# Altium project ODrive_Foc.PrjPcb
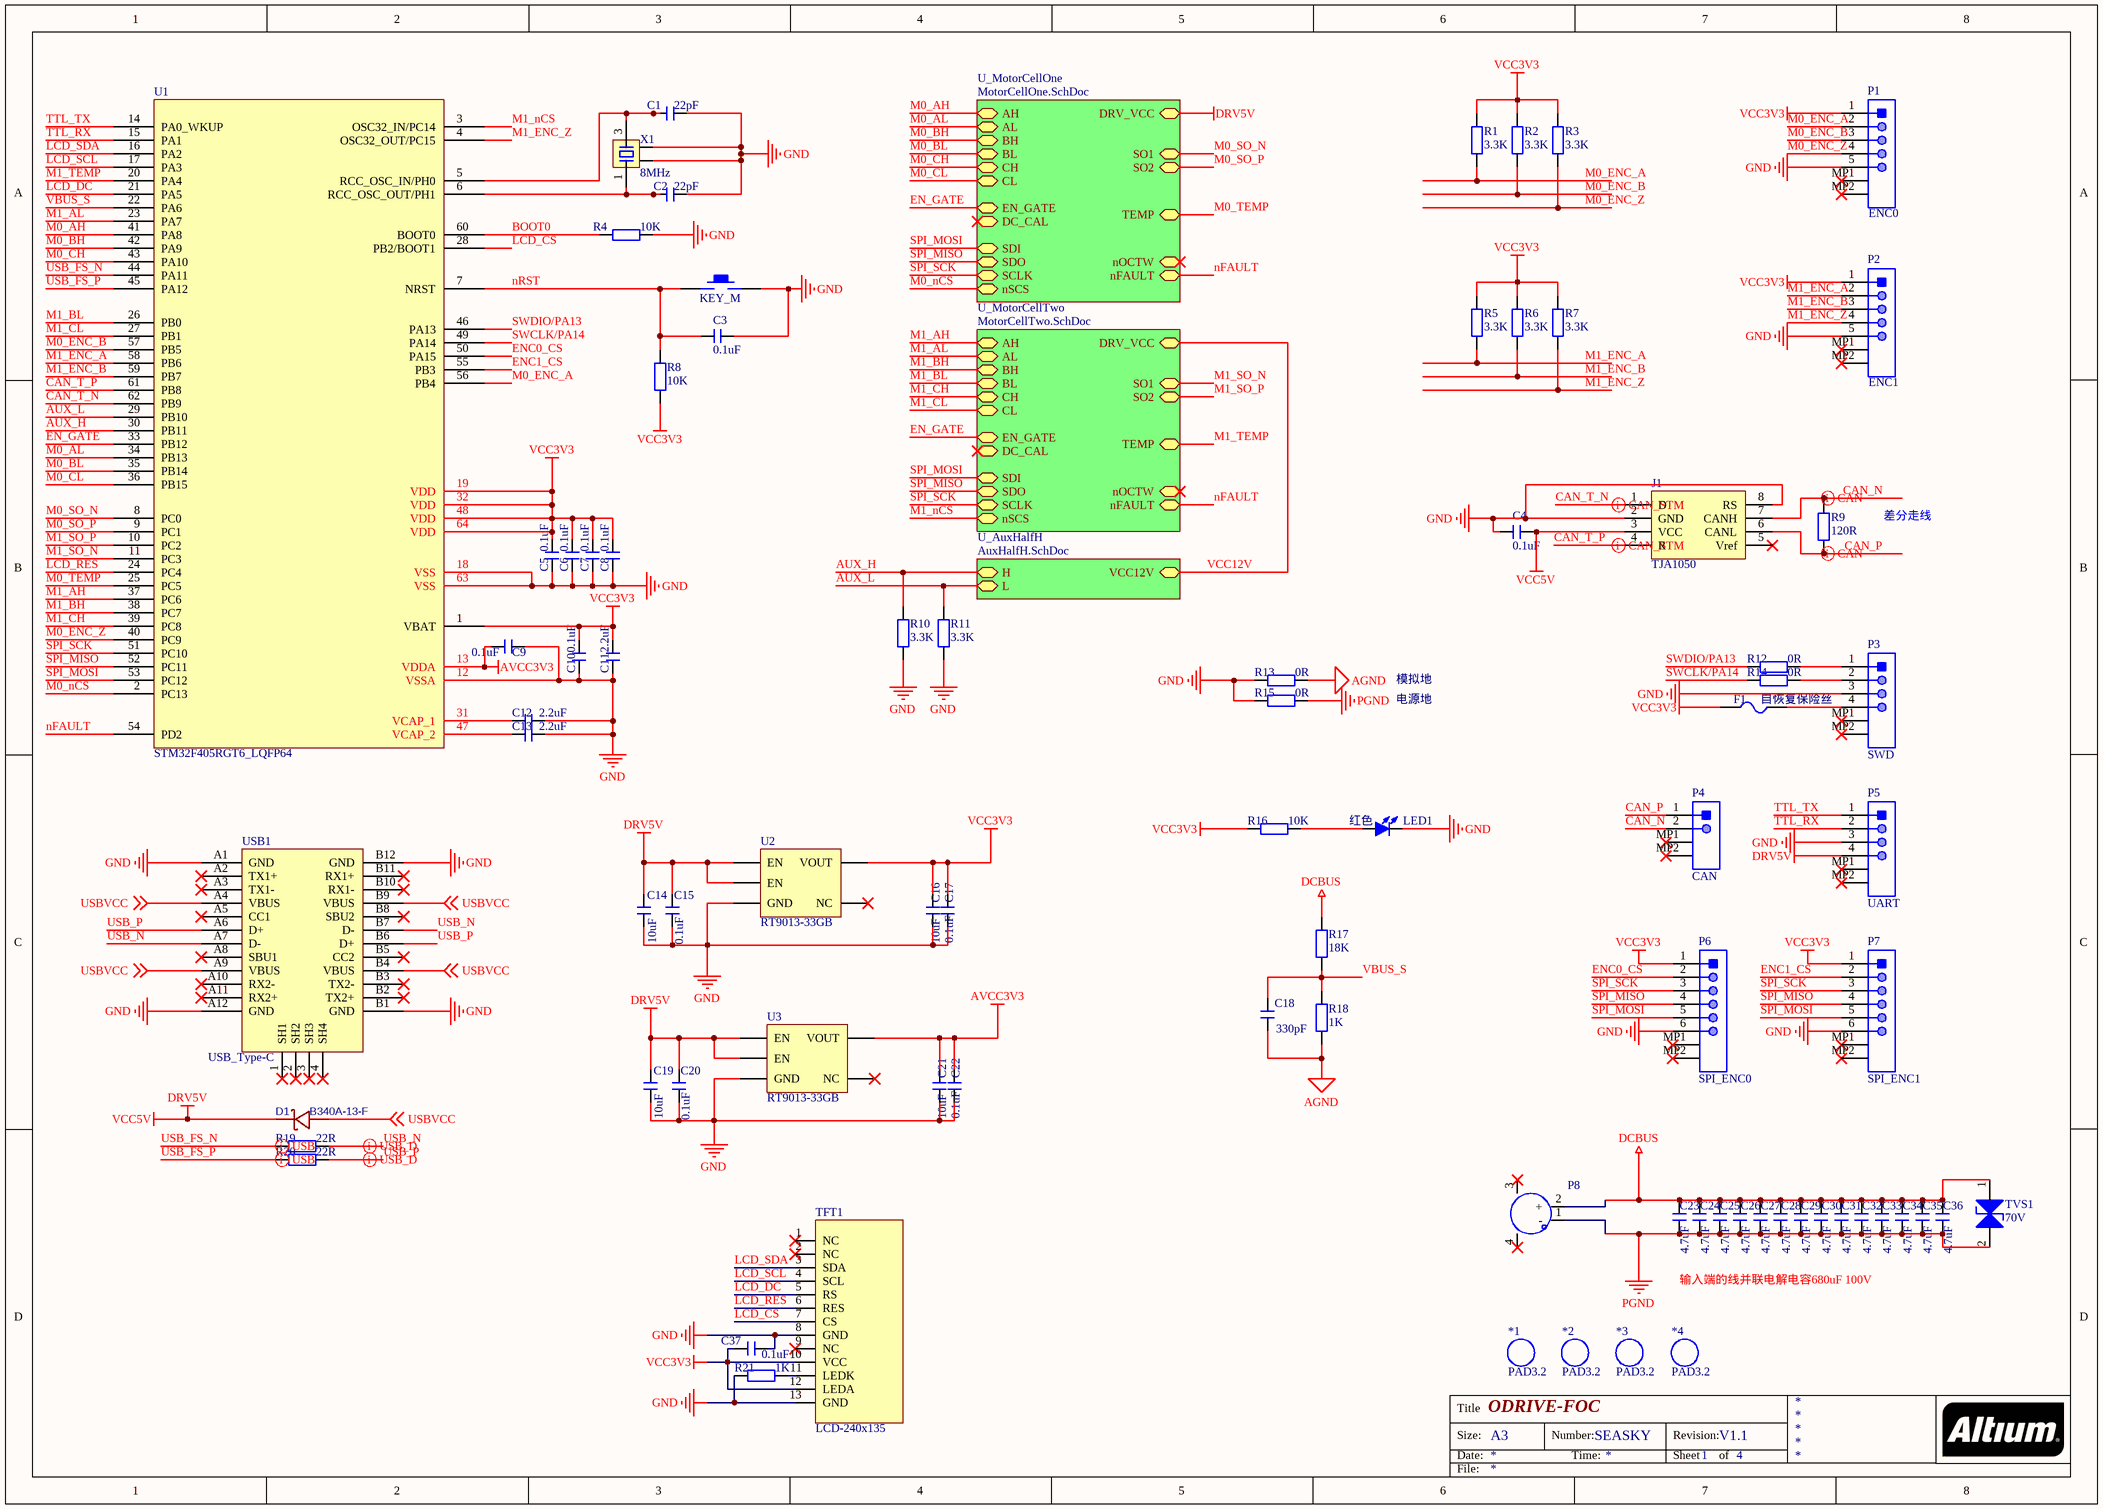
[diagram p0: CoreCtrl.SchDoc]
4 sheets, 201 parts. Net scope: hierarchical (ports join the sheet entries above them; power ports are global).
Board file: Drive_Foc.PcbDoc
Sheets:
  CoreCtrl.SchDoc
    U_AuxHalfH = AuxHalfH.SchDoc
    U_MotorCellOne = MotorCellOne.SchDoc
    U_MotorCellTwo = MotorCellTwo.SchDoc

## Sheet CoreCtrl.SchDoc: ODRIVE-FOC
size A3; Author: SEASKY; DocumentNumber: SEASKY; Revision: V1.1; SheetNumber: 1; SheetTotal: 4; Application_BuildNumber: 0

### Parts
*1  PAD3.2  [PAD3.2]
*2  PAD3.2  [PAD3.2]
*3  PAD3.2  [PAD3.2]
*4  PAD3.2  [PAD3.2]
C1  22pF  [C 0603_L]
C2  22pF  [C 0603_L]
C3  0.1uF  [C 0603_L]
C4  0.1uF  [C 0603_L]
C5  0.1uF  [C 0603_L]
C6  0.1uF  [C 0603_L]
C7  0.1uF  [C 0603_L]
C8  0.1uF  [C 0603_L]
C9  0.1uF  [C 0603_L]
C10  0.1uF  [C 0603_L]
C11  2.2uF  [C 0603_L]
C12  2.2uF  [C 0603_L]
C13  2.2uF  [C 0603_L]
C14  10uF  [C 0805_L]
C15  0.1uF  [C 0805_L]
C16  10uF  [C 0805_L]
C17  0.1uF  [C 0805_L]
C18  330pF  [C 0603_L]
C19  10uF  [C 0805_L]
C20  0.1uF  [C 0805_L]
C21  10uF  [C 0805_L]
C22  0.1uF  [C 0805_L]
C23  4.7uF  [C 1210_L]
C24  4.7uF  [C 1210_L]
C25  4.7uF  [C 1210_L]
C26  4.7uF  [C 1210_L]
C27  4.7uF  [C 1210_L]
C28  4.7uF  [C 1210_L]
C29  4.7uF  [C 1210_L]
C30  4.7uF  [C 1210_L]
C31  4.7uF  [C 1210_L]
C32  4.7uF  [C 1210_L]
C33  4.7uF  [C 1210_L]
C34  4.7uF  [C 1210_L]
C35  4.7uF  [C 1210_L]
C36  4.7uF  [C 1210_L]
C37  0.1uF  [C 0603_L]
D1  B340A-13-F  [SMA_L4.4-W2.6-LS5.0-RD]
F1  自恢复保险丝  [FU 0603]
J1  TJA1050  [SOIC-8_150mil]
LED1  红色  [LED 0805G]
P1  ENC0  [JST-SM05B-GHS-TB_V]
P2  ENC1  [JST-SM05B-GHS-TB_V]
P3  SWD  [JST-SM04B-GHS-TB_V]
P4  CAN  [CONN-SMD_SM02B-GHS-TB-LF-SN]
P5  UART  [JST-SM04B-GHS-TB_V]
P6  SPI_ENC0  [JST-BM06B-GHS-TBT_V]
P7  SPI_ENC1  [JST-BM06B-GHS-TBT_V]
P8  XT60PW  [XT60PW]  (value not drawn)
R1  3.3K  [R 0603_L]
R2  3.3K  [R 0603_L]
R3  3.3K  [R 0603_L]
R4  10K  [R 0603_L]
R5  3.3K  [R 0603_L]
R6  3.3K  [R 0603_L]
R7  3.3K  [R 0603_L]
R8  10K  [R 0603_L]
R9  120R  [R 0603_L]
R10  3.3K  [R 0603_L]
R11  3.3K  [R 0603_L]
R12  0R  [R 0603_L]
R13  0R  [R 0603_L]
R14  0R  [R 0603_L]
R15  0R  [R 0603_L]
R16  10K  [R 0603_L]
R17  18K  [R 0603_L]
R18  1K  [R 0603_L]
R19  22R  [R 0603_L]
R20  22R  [R 0603_L]
R21  1K  [R 0603_L]
RST1  KEY_M  [SMD-3.2*4.2]
TFT1  LCD-240x135  [LCD-240x135]
TVS1  70V  [SMA(DO-214AC)]
U1  STM32F405RGT6_LQFP64  [LQFP-64_10X10X05P]
U2  RT9013-33GB  [SOT23-5M]
U3  RT9013-33GB  [SOT23-5M]
USB1  USB_Type-C  [Type-C-TOP]
X1  8MHz  [OSC 3225-4P]

### Sub-sheets
U_AuxHalfH = AuxHalfH.SchDoc: L (bidir), H (bidir), VCC12V (bidir)
U_MotorCellOne = MotorCellOne.SchDoc: EN_GATE (bidir), AH (bidir), nSCS (bidir), BL (bidir), DC_CAL (bidir), SDI (bidir), SCLK (bidir), nOCTW (bidir), SDO (bidir), BH (bidir), nFAULT (bidir), SO2 (bidir), CL (bidir), CH (bidir), SO1 (bidir), AL (bidir), TEMP (bidir), DRV_VCC (bidir)
U_MotorCellTwo = MotorCellTwo.SchDoc: nSCS (bidir), nOCTW (bidir), SCLK (bidir), AH (bidir), nFAULT (bidir), SDI (bidir), TEMP (bidir), SO1 (bidir), SO2 (bidir), AL (bidir), BL (bidir), SDO (bidir), CL (bidir), BH (bidir), DC_CAL (bidir), EN_GATE (bidir), CH (bidir), DRV_VCC (bidir)

### Nets
AGND: C18.2 R13.1 R18.2
AVCC3V3: C9.2 C21.2 C22.2 U1.13(VDDA) U3.5(VOUT)
DCBUS: C23.2 C24.2 C25.2 C26.2 C27.2 C28.2 C29.2 C30.2 C31.2 C32.2 C33.2 C34.2 C35.2 C36.2 P8.2(+) R17.1 TVS1.1
DRV5V: C4.1 C14.2 C15.2 C19.2 C20.2 D1.1(K) J1.3(VCC) P5.4 U2.1(EN) U2.3(EN) U3.1(EN) U3.3(EN) ; sheet U_MotorCellOne/DRV_VCC  [also labelled VCC5V]
GND: C1.2 C2.2 C3.1 C4.2 C5.1 C6.1 C7.1 C8.1 C9.1 C10.1 C11.1 C12.2 C13.2 C14.1 C15.1 C16.1 C17.1 C19.1 C20.1 C21.1 C22.1 C37.1 J1.2(GND) J1.8(RS) LED1.2(K) P1.5 P2.5 P3.3 P5.3 P6.6 P7.6 R4.1 R10.2 R11.2 R13.2 R15.2 R21.1 RST1.2 TFT1.8(GND) TFT1.13(GND) U1.12(VSSA) U1.18(VSS) U1.63(VSS) U2.2(GND) U3.2(GND) USB1.A1(GND) USB1.A12(GND) USB1.B1(GND) USB1.B12(GND) X1.2 X1.4
PGND: C23.1 C24.1 C25.1 C26.1 C27.1 C28.1 C29.1 C30.1 C31.1 C32.1 C33.1 C34.1 C35.1 C36.1 P8.1(-) R15.1 TVS1.2
VCC3V3: C5.2 C6.2 C7.2 C8.2 C10.2 C11.2 C16.2 C17.2 C37.2 F1.2 P1.1 P2.1 P6.1 P7.1 R1.1 R2.1 R3.1 R5.1 R6.1 R7.1 R8.1 R16.1 TFT1.10(VCC) TFT1.12(LEDA) U1.1(VBAT) U1.19(VDD) U1.32(VDD) U1.48(VDD) U1.64(VDD) U2.5(VOUT)
AUX_H: R10.1 U1.30(PB11) ; sheet U_AuxHalfH/H
AUX_L: R11.1 U1.29(PB10) ; sheet U_AuxHalfH/L
BOOT0: R4.2 U1.60(BOOT0)  [project net BOOT0_1]
CAN_N: J1.7(CANH) P4.2 R9.1  [project net CAN_N_1]
CAN_P: J1.6(CANL) P4.1 R9.2  [project net CAN_P_1]
CAN_T_N: J1.1(D) U1.62(PB9)  [project net CAN_T_N_1]
CAN_T_P: J1.4(R) U1.61(PB8)  [project net CAN_T_P_1]
EN_GATE: U1.33(PB12) ; sheet U_MotorCellOne/EN_GATE, sheet U_MotorCellTwo/EN_GATE
ENC0_CS: P6.2 U1.50(PA15)  [project net ENC0_CS_1]
ENC1_CS: P7.2 U1.55(PB3)  [project net ENC1_CS_1]
LCD_CS: TFT1.7(CS) U1.28(PB2/BOOT1)  [project net LCD_CS_1]
LCD_DC: TFT1.5(RS) U1.21(PA5)  [project net LCD_DC_1]
LCD_RES: TFT1.6(RES) U1.24(PC4)  [project net LCD_RES_1]
LCD_SCL: TFT1.4(SCL) U1.17(PA3)  [project net LCD_SCL_1]
LCD_SDA: TFT1.3(SDA) U1.16(PA2)  [project net LCD_SDA_1]
M0_AH: U1.41(PA8) ; sheet U_MotorCellOne/AH
M0_AL: U1.34(PB13) ; sheet U_MotorCellOne/AL
M0_BH: U1.42(PA9) ; sheet U_MotorCellOne/BH
M0_BL: U1.35(PB14) ; sheet U_MotorCellOne/BL
M0_CH: U1.43(PA10) ; sheet U_MotorCellOne/CH
M0_CL: U1.36(PB15) ; sheet U_MotorCellOne/CL
M0_ENC_A: P1.2 R1.2 U1.56(PB4)  [project net M0_ENC_A_1]
M0_ENC_B: P1.3 R2.2 U1.57(PB5)  [project net M0_ENC_B_1]
M0_ENC_Z: P1.4 R3.2 U1.40(PC9)  [project net M0_ENC_Z_1]
M0_nCS: U1.2(PC13) ; sheet U_MotorCellOne/nSCS
M0_SO_N: U1.8(PC0) ; sheet U_MotorCellOne/SO1
M0_SO_P: U1.9(PC1) ; sheet U_MotorCellOne/SO2
M0_TEMP: U1.25(PC5) ; sheet U_MotorCellOne/TEMP
M1_AH: U1.37(PC6) ; sheet U_MotorCellTwo/AH
M1_AL: U1.23(PA7) ; sheet U_MotorCellTwo/AL
M1_BH: U1.38(PC7) ; sheet U_MotorCellTwo/BH
M1_BL: U1.26(PB0) ; sheet U_MotorCellTwo/BL
M1_CH: U1.39(PC8) ; sheet U_MotorCellTwo/CH
M1_CL: U1.27(PB1) ; sheet U_MotorCellTwo/CL
M1_ENC_A: P2.2 R5.2 U1.58(PB6)  [project net M1_ENC_A_1]
M1_ENC_B: P2.3 R6.2 U1.59(PB7)  [project net M1_ENC_B_1]
M1_ENC_Z: P2.4 R7.2 U1.4(OSC32_OUT/PC15)  [project net M1_ENC_Z_1]
M1_nCS: U1.3(OSC32_IN/PC14) ; sheet U_MotorCellTwo/nSCS
M1_SO_N: U1.11(PC3) ; sheet U_MotorCellTwo/SO1
M1_SO_P: U1.10(PC2) ; sheet U_MotorCellTwo/SO2
M1_TEMP: U1.20(PA4) ; sheet U_MotorCellTwo/TEMP
nFAULT: U1.54(PD2) ; sheet U_MotorCellOne/nFAULT, sheet U_MotorCellTwo/nFAULT
nRST: C3.2 R8.2 RST1.1 U1.7(NRST)  [project net nRST_1]
SPI_MISO: P6.4 P7.4 U1.52(PC11) ; sheet U_MotorCellOne/SDO, sheet U_MotorCellTwo/SDO
SPI_MOSI: P6.5 P7.5 U1.53(PC12) ; sheet U_MotorCellOne/SDI, sheet U_MotorCellTwo/SDI
SPI_SCK: P6.3 P7.3 U1.51(PC10) ; sheet U_MotorCellOne/SCLK, sheet U_MotorCellTwo/SCLK
SWCLK/PA14: R14.2 U1.49(PA14)  [project net SWCLK/PA14_1]
SWDIO/PA13: R12.2 U1.46(PA13)  [project net SWDIO/PA13_1]
TTL_RX: P5.2 U1.15(PA1)  [project net TTL_RX_1]
TTL_TX: P5.1 U1.14(PA0_WKUP)  [project net TTL_TX_1]
USB_FS_N: R19.1 U1.44(PA11)  [project net USB_FS_N_1]
USB_FS_P: R20.1 U1.45(PA12)  [project net USB_FS_P_1]
USB_N: R19.2 USB1.A7(D-) USB1.B7(D-)  [project net USB_N_1]
USB_P: R20.2 USB1.A6(D+) USB1.B6(D+)  [project net USB_P_1]
USBVCC: D1.2(A) USB1.A4(VBUS) USB1.A9(VBUS) USB1.B4(VBUS) USB1.B9(VBUS) ; off-sheet USBVCC
VBUS_S: C18.1 R17.2 R18.1 U1.22(PA6)  [project net VBUS_S_1]
VCC12V: sheet U_AuxHalfH/VCC12V, sheet U_MotorCellTwo/DRV_VCC
NetC1_1: C1.1 U1.5(RCC_OSC_IN/PH0) X1.3
NetC2_1: C2.1 U1.6(RCC_OSC_OUT/PH1) X1.1
NetC12_1: C12.1 U1.31(VCAP_1)
NetC13_1: C13.1 U1.47(VCAP_2)
NetF1_1: F1.1 P3.4
NetLED1_1: LED1.1(A) R16.2
NetP3_1: P3.1 R12.1
NetP3_2: P3.2 R14.1
NetR21_2: R21.2 TFT1.11(LEDK)

Not connected (* = marked no-connect by the designer): J1 5(Vref)*; P1 MP1* MP2*; P2 MP1* MP2*; P3 MP1* MP2*; P4 MP1(3)* MP2*; P5 MP1* MP2*; P6 MP1* MP2*; P7 MP1* MP2*; P8 3* 4*; TFT1 1(NC)* 2(NC)* 9(NC)*; U2 4(NC)*; U3 4(NC)*; USB1 1(SH1)* 2(SH2)* 3(SH3)* 4(SH4)* A2(TX1+)* A3(TX1-)* A5(CC1)* A8(SBU1)* A10(RX2-)* A11(RX2+)* B2(TX2+)* B3(TX2-)* B5(CC2)* B8(SBU2)* B10(RX1-)* B11(RX1+)*

### Layout directives
differential pair: CAN_N_1, CAN_P_1, CAN_T_N_1, CAN_T_P_1, USB_FS_N_1, USB_FS_P_1, USB_N_1, USB_P_1

### Notes on the sheet
- 差分走线
- 模拟地
- 电源地
- 输入端的线并联电解电容680uF 100V
- Title
- Size:
- Date:
- A3
- Number:
- Time:
- Revision:
- Sheet
- of
- File:

### Library data of the parts
C1-C37 = C: 贴片电容
D1 = B340A-13-F: BOM_Manufacturer: DIODES; SMT Type: Extend; BOM_Supplier: LCSC; BOM_Manufacturer Part: B340A-13-F; BOM_Supplier Part: C85098; BOM_JLCPCB SMD: Yes; spicePre: D; spiceSymbolName: B340A-13-F
F1 = FU: 贴片保险丝
J1 = TJA1050: CAN芯片
LED1 = LED-SMD: 贴片LED
P1 P2 = SM05B-GHS-TB(LF)(SN): GH Disconnectable Crimp Style Connector, Pitch 1.25 mm, 1 x 5 Position, Height 4.25 mm, -25 to 85 degC, RoHS, Tape and Reel; Manufacturer: JST; No of Positions: 5; Pitch: 1.25mm; Style/Orientation: RightAngleHeader/Plug; Package Reference: SM05B-GHS-TB; Type: WiretoBoard; Datasheet URL: http://www.jst-mfg.com/product/pdf/eng/eGH.pdf; Termination: Crimp; Manufacturer URL: http://www.jst.com/home2.html; Mounting Technology: SurfaceMount; Datasheet Version: 05/2016; Package Description: GH Disconnectable Crimp Style Connector, Pitch 1.25 mm, 1 x 5 Position, Height 4.25 mm
P3 P5 = SM04B-GHS-TB(LF)(SN): GH Disconnectable Crimp Style Connector, Pitch 1.25 mm, 1 x 4 Position, Height 4.25 mm, -25 to 85 degC, RoHS, Tape and Reel; Manufacturer: JST; No of Positions: 4; Pitch: 1.25mm; Style/Orientation: RightAngleHeader/Plug; Package Reference: SM04B-GHS-TB; Type: WiretoBoard; Datasheet URL: http://www.jst-mfg.com/product/pdf/eng/eGH.pdf; Termination: Crimp; Manufacturer URL: http://www.jst.com/home2.html; Mounting Technology: SurfaceMount; Datasheet Version: 05/2016; Package Description: GH Disconnectable Crimp Style Connector, Pitch 1.25 mm, 1 x 4 Position, Height 4.25 mm
P4 = SM02B-GHS-TB(LF)(SN)
P6 = SM06B-GHS-TB(LF)(SN): GH Disconnectable Crimp Style Connector, Pitch 1.25 mm, 1 x 6 Position, Height 4.25 mm, -25 to 85 degC, RoHS, Tape and Reel; Manufacturer: JST; No of Positions: 6; Pitch: 1.25mm; Style/Orientation: RightAngleHeader/Plug; Package Reference: SM06B-GHS-TB; Type: WiretoBoard; Datasheet URL: http://www.jst-mfg.com/product/pdf/eng/eGH.pdf; Termination: Crimp; Manufacturer URL: http://www.jst.com/home2.html; Mounting Technology: SurfaceMount; Datasheet Version: 05/2016; Package Description: GH Disconnectable Crimp Style Connector, Pitch 1.25 mm, 1 x 6 Position, Height 4.25 mm
P7 = BM06B-GHS-TBT(LF)(SN): GH Disconnectable Crimp Style Connector, Pitch 1.25 mm, 1 x 6 Position, Height 4.05 mm, -25 to 85 degC, RoHS, Tape and Reel; Manufacturer: JST; No of Positions: 6; Pitch: 1.25mm; Style/Orientation: StraightHeader/Plug; Package Reference: BM06B-GHS-TBT; Type: WiretoBoard; Datasheet URL: http://www.jst-mfg.com/product/pdf/eng/eGH.pdf; Termination: Crimp; Manufacturer URL: http://www.jst.com/home2.html; Mounting Technology: SurfaceMount; Datasheet Version: 05/2016; Package Description: GH Disconnectable Crimp Style Connector, Pitch 1.25 mm, 1 x 6 Position, Height 4.05 mm
R1-R21 = R: 贴片电阻
TVS1 = SMAJ28CA
X1 = XTAL-4P: 4脚无源晶振

## Sheet AuxHalfH.SchDoc: ODRIVE-FOC
size A3; DocumentNumber: SEASKY; Revision: V1.1
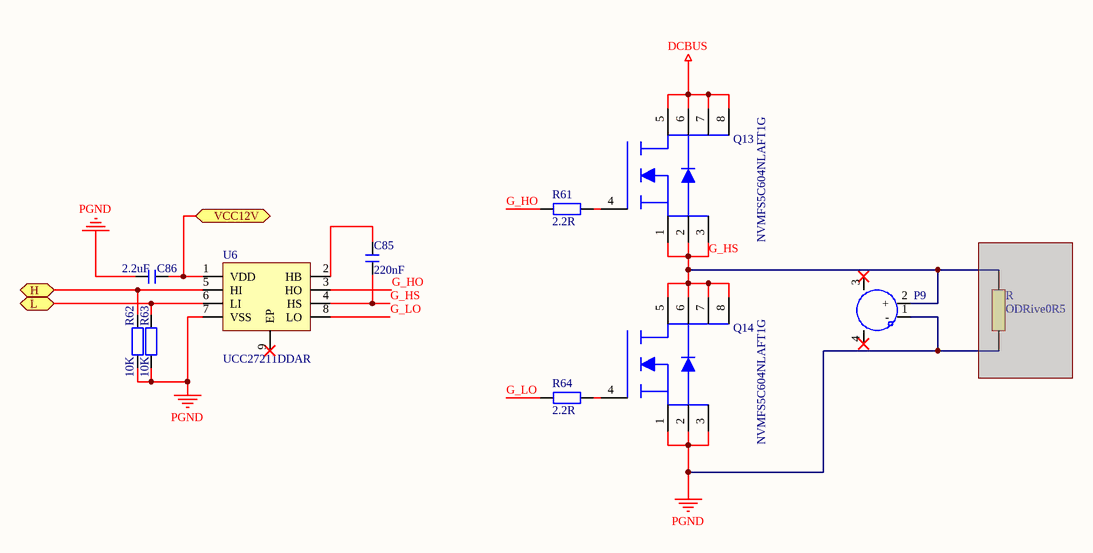
[diagram p1: AuxHalfH.SchDoc]

### Parts
C85  220nF  [C 0805_L]
C86  2.2uF  [C 0603_L]
P9  XT60PW  [XT60PW]  (value not drawn)
Q13  NVMFS5C604NLAFT1G  [PG-TDSON-8_L5.0-W6.0-P1.27-LS6.2-BL-EP]
Q14  NVMFS5C604NLAFT1G  [PG-TDSON-8_L5.0-W6.0-P1.27-LS6.2-BL-EP]
R  ODRive0R5  [ODrive_0R5]  (masked out: inside a compile mask, not in the netlist)
R61  2.2R  [R 0603_L]
R62  10K  [R 0603_L]
R63  10K  [R 0603_L]
R64  2.2R  [R 0603_L]
U6  UCC27211DDAR  [SO-8_EP]

### Ports
H (bidir), L (bidir), VCC12V (bidir)

### Nets
DCBUS: Q13.5 Q13.6 Q13.7 Q13.8
PGND: C86.2 P9.1(-) Q14.1 Q14.2 Q14.3 R62.1 R63.1 U6.7(VSS)
AUX_H: R62.2 U6.5(HI) ; port H
AUX_L: R63.2 U6.6(LI) ; port L
G_HO: R61.1 U6.3(HO)
G_HS: C85.1 P9.2(+) Q13.1 Q13.2 Q13.3 Q14.5 Q14.6 Q14.7 Q14.8 U6.4(HS)
G_LO: R64.1 U6.8(LO)
VCC12V: C86.1 U6.1(VDD) ; port VCC12V
NetC85_2: C85.2 U6.2(HB)
NetQ13_4: Q13.4 R61.2
NetQ14_4: Q14.4 R64.2

Not connected (* = marked no-connect by the designer): P9 3* 4*; U6 9(EP)*

### Notes on the sheet
- Title
- Size:
- Date:
- A3
- Number:
- Time:
- Revision:
- Sheet
- of
- File:

### Library data of the parts
C85 C86 = C: 贴片电容
Q13 Q14 = BSC037N08NS5ATMA1
R61-R64 = R: 贴片电阻

## Sheet MotorCellOne.SchDoc: ODRIVE-FOC
size A3; DocumentNumber: SEASKY; Revision: V1.1
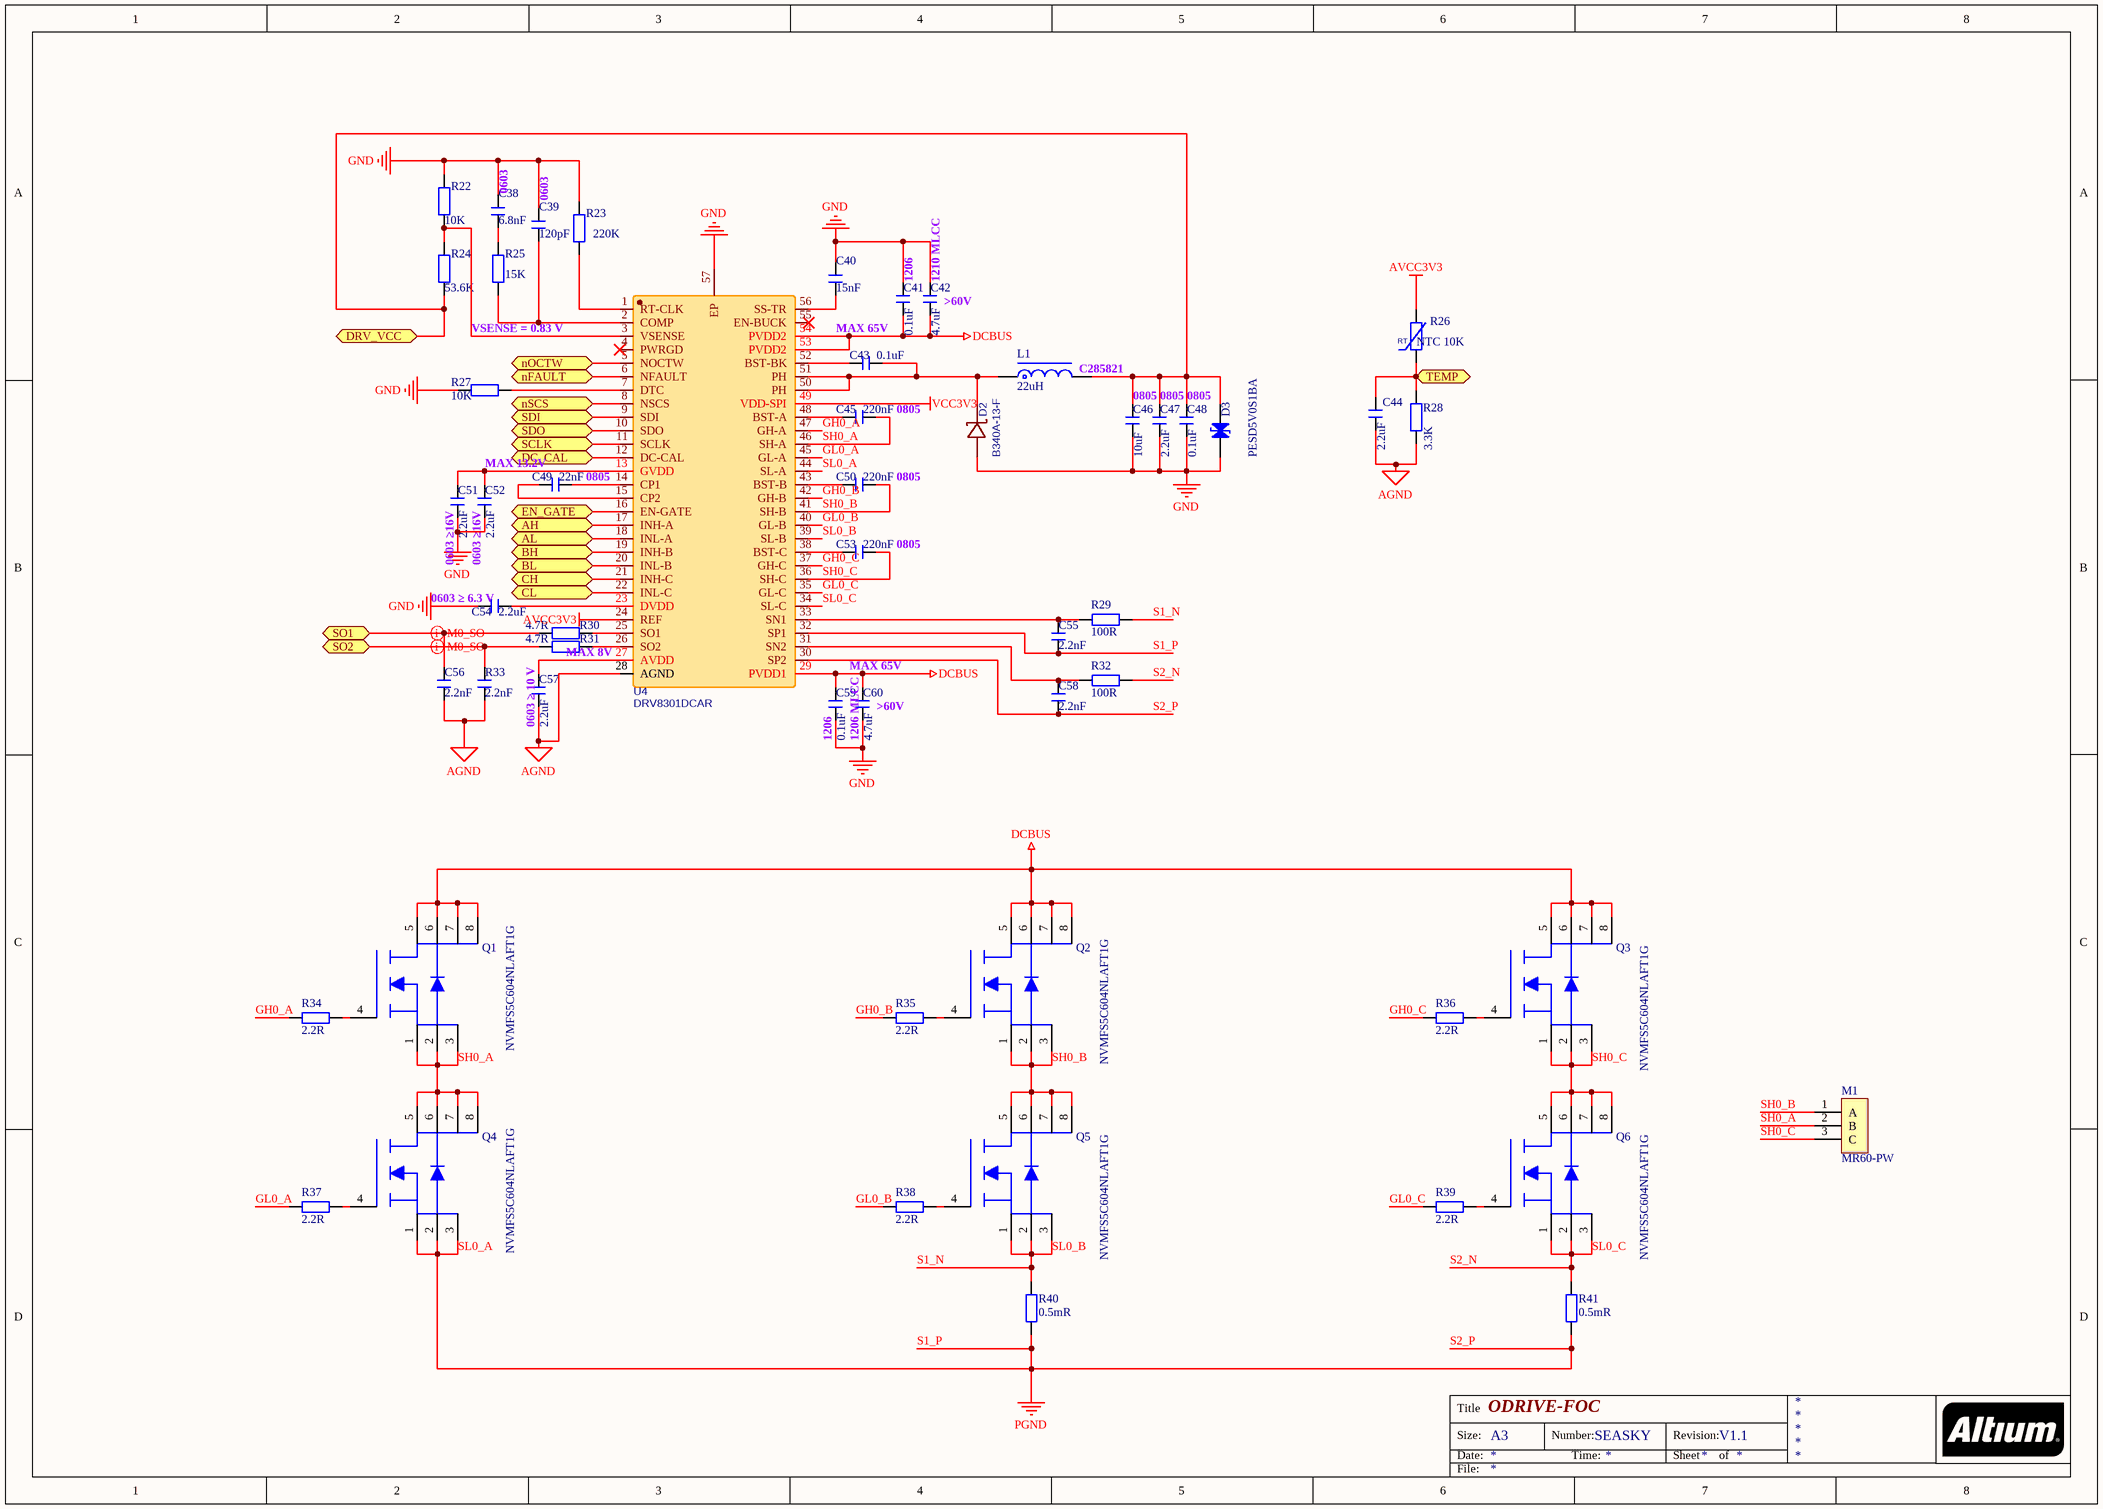
[diagram p2: MotorCellOne.SchDoc]

### Parts
C38  6.8nF  [C 0603_L]
C39  120pF  [C 0603_L]
C40  15nF  [C 0603_L]
C41  0.1uF  [C 1206_L]
C42  4.7uF  [C 1210_L]
C43  0.1uF  [C 0603_L]
C44  2.2uF  [C 0603_L]
C45  220nF  [C 0805_L]
C46  10uF  [C 0805_L]
C47  2.2uF  [C 0805_L]
C48  0.1uF  [C 0805_L]
C49  22nF  [C 0805_L]
C50  220nF  [C 0805_L]
C51  2.2uF  [C 0603_L]
C52  2.2uF  [C 0603_L]
C53  220nF  [C 0805_L]
C54  2.2uF  [C 0603_L]
C55  2.2nF  [C 0603_L]
C56  2.2nF  [C 0603_L]
C57  2.2uF  [C 0603_L]
C58  2.2nF  [C 0603_L]
C59  0.1uF  [C 1206_L]
C60  4.7uF  [C 1210_L]
D2  B340A-13-F  [SMA_L4.4-W2.6-LS5.0-RD]
D3  PESD5V0S1BA  [SOD-323]
L1  22uH  [CD53]
M1  MR60-PW  [MR30-PW]
Q1  NVMFS5C604NLAFT1G  [PG-TDSON-8_L5.0-W6.0-P1.27-LS6.2-BL-EP]
Q2  NVMFS5C604NLAFT1G  [PG-TDSON-8_L5.0-W6.0-P1.27-LS6.2-BL-EP]
Q3  NVMFS5C604NLAFT1G  [PG-TDSON-8_L5.0-W6.0-P1.27-LS6.2-BL-EP]
Q4  NVMFS5C604NLAFT1G  [PG-TDSON-8_L5.0-W6.0-P1.27-LS6.2-BL-EP]
Q5  NVMFS5C604NLAFT1G  [PG-TDSON-8_L5.0-W6.0-P1.27-LS6.2-BL-EP]
Q6  NVMFS5C604NLAFT1G  [PG-TDSON-8_L5.0-W6.0-P1.27-LS6.2-BL-EP]
R22  10K  [R 0603_L]
R23  220K  [R 0603_L]
R24  53.6K  [R 0603_L]
R25  15K  [R 0603_L]
R26  NTC 10K  [R 0805-HP_L]
R27  10K  [R 0603_L]
R28  3.3K  [R 0805_L]
R29  100R  [R 0603_L]
R30  4.7R  [R 0603_L]
R31  4.7R  [R 0603_L]
R32  100R  [R 0603_L]
R33  2.2nF  [C 0603_L]
R34  2.2R  [R 0603_L]
R35  2.2R  [R 0603_L]
R36  2.2R  [R 0603_L]
R37  2.2R  [R 0603_L]
R38  2.2R  [R 0603_L]
R39  2.2R  [R 0603_L]
R40  0.5mR  [R3920]
R41  0.5mR  [R3920]
U4  DRV8301DCAR  [HTSSOP-56_L14.0-W6.0-P0.50-LS8.0-BL]

### Ports
AH (bidir), AL (bidir), BH (bidir), BL (bidir), CH (bidir), CL (bidir), DC_CAL (bidir), DRV_VCC (bidir), EN_GATE (bidir), nFAULT (bidir), nOCTW (bidir), nSCS (bidir), SCLK (bidir), SDI (bidir), SDO (bidir), SO1 (bidir), SO2 (bidir), TEMP (bidir)

### Nets
AGND: C44.2 C56.1 C57.1 R28.1 R33.1 U4.28(AGND)
AVCC3V3: R26.2 U4.24(REF)
DCBUS: C41.1 C42.1 C59.2 C60.2 Q1.5 Q1.6 Q1.7 Q1.8 Q2.5 Q2.6 Q2.7 Q2.8 Q3.5 Q3.6 Q3.7 Q3.8 U4.29(PVDD1) U4.53(PVDD2) U4.54(PVDD2)
DRV5V: C46.2 C47.2 C48.2 D3.1(A) L1.2 R24.1 ; port DRV_VCC
GND: C38.1 C39.1 C40.1 C41.2 C42.2 C46.1 C47.1 C48.1 C51.1 C52.1 C54.1 C59.1 C60.1 D2.2(A) D3.2(K) R22.2 R23.2 R27.2 U4.57(EP)
PGND: C55.1 C58.1 Q4.1 Q4.2 Q4.3 R40.1 R41.1 U4.30(SP2) U4.32(SP1) U4.44(SL-A)  [also labelled S1_P, S2_P, SL0_A]
VCC3V3: U4.49(VDD-SPI)
EN_GATE: U4.16(EN-GATE) ; port EN_GATE
GH0_A: R34.1 U4.47(GH-A)
GH0_B: R35.1 U4.42(GH-B)
GH0_C: R36.1 U4.37(GH-C)
GL0_A: R37.1 U4.45(GL-A)
GL0_B: R38.1 U4.40(GL-B)
GL0_C: R39.1 U4.35(GL-C)
M0_AH: U4.17(INH-A) ; port AH
M0_AL: U4.18(INL-A) ; port AL
M0_BH: U4.19(INH-B) ; port BH
M0_BL: U4.20(INL-B) ; port BL
M0_CH: U4.21(INH-C) ; port CH
M0_CL: U4.22(INL-C) ; port CL
M0_nCS: U4.8(NSCS) ; port nSCS
M0_SO_N: C56.2 R30.1 ; port SO1
M0_SO_P: R31.1 R33.2 ; port SO2
M0_TEMP: C44.1 R26.1 R28.2 ; port TEMP
nFAULT: U4.6(NFAULT) ; port nFAULT
S1_N: Q5.1 Q5.2 Q5.3 R29.2 R40.2 U4.39(SL-B)  [also labelled SL0_B]
S2_N: Q6.1 Q6.2 Q6.3 R32.2 R41.2 U4.34(SL-C)  [also labelled SL0_C]
SH0_A: C45.2 M1.2(B) Q1.1 Q1.2 Q1.3 Q4.5 Q4.6 Q4.7 Q4.8 U4.46(SH-A)
SH0_B: C50.2 M1.1(A) Q2.1 Q2.2 Q2.3 Q5.5 Q5.6 Q5.7 Q5.8 U4.41(SH-B)
SH0_C: C53.2 M1.3(C) Q3.1 Q3.2 Q3.3 Q6.5 Q6.6 Q6.7 Q6.8 U4.36(SH-C)
SPI_MISO: U4.10(SDO) ; port SDO
SPI_MOSI: U4.9(SDI) ; port SDI
SPI_SCK: U4.11(SCLK) ; port SCLK
NetC38_2: C38.2 R25.2
NetC39_2: C39.2 R25.1 U4.2(COMP)
NetC40_2: C40.2 U4.56(SS-TR)
NetC43_1: C43.1 D2.1(K) L1.1 U4.50(PH) U4.51(PH)
NetC43_2: C43.2 U4.52(BST-BK)
NetC45_1: C45.1 U4.48(BST-A)
NetC49_1: C49.1 U4.14(CP1)
NetC49_2: C49.2 U4.15(CP2)
NetC50_1: C50.1 U4.43(BST-B)
NetC51_2: C51.2 C52.2 U4.13(GVDD)
NetC53_1: C53.1 U4.38(BST-C)
NetC54_2: C54.2 U4.23(DVDD)
NetC55_2: C55.2 R29.1 U4.33(SN1)
NetC57_2: C57.2 U4.27(AVDD)
NetC58_2: C58.2 R32.1 U4.31(SN2)
NetQ1_4: Q1.4 R34.2
NetQ2_4: Q2.4 R35.2
NetQ3_4: Q3.4 R36.2
NetQ4_4: Q4.4 R37.2
NetQ5_4: Q5.4 R38.2
NetQ6_4: Q6.4 R39.2
NetR22_1: R22.1 R24.2 U4.3(VSENSE)
NetR23_1: R23.1 U4.1(RT-CLK)
NetR27_1: R27.1 U4.7(DTC)
NetR30_2: R30.2 U4.25(SO1)
NetR31_2: R31.2 U4.26(SO2)
NetU4_5: U4.5(NOCTW) ; port nOCTW
NetU4_12: U4.12(DC-CAL) ; port DC_CAL

Not connected (* = marked no-connect by the designer): U4 4(PWRGD)* 55(EN-BUCK)*

### Layout directives
differential pair: M0_SO_N, M0_SO_P

### Notes on the sheet
- (near C38) 0603
- 0603
- 1206
- (near C42) >60V
- (near C42) 1210 MLCC
- VSENSE = 0.83 V
- MAX 65V
- (near L1) C285821
- 0805
- MAX 13.2V
- (near C50) 0805
- (near C51) 0603 ≥16V
- (near C52) 0603 ≥16V
- (near C53) 0805
- (near C54) 0603 ≥ 6.3 V
- (near C57) 0603 ≥ 10 V
- (near R31) MAX 8V
- (near C60) >60V
- (near C59) 1206
- (near C60) 1206 MLCC
- Title
- Size:
- Date:
- A3
- Number:
- Time:
- Revision:
- Sheet
- of
- File:

### Library data of the parts
C38-C60 R33 = C: 贴片电容
D2 = B340A-13-F: as D1 on sheet CoreCtrl; BOM_Supplier: LCSC; BOM_Manufacturer Part: B340A-13-F; BOM_Supplier Part: C85098; BOM_JLCPCB SMD: Yes; spicePre: D; spiceSymbolName: B340A-13-F
D3 = PESD5V0S1BA: PESD5V0S1BA、ESD二极管、5V
L1 = L-SMD: CD系列贴片线绕功率电感
Q1-Q6 = BSC037N08NS5ATMA1
R22-R25 R27-R32 R34-R39 = R: 贴片电阻
R26 = RT: 热敏电阻
R40 R41 = R-Precision: 精密贴片电阻
U4 = DRV8301DCAR: BOM_Manufacturer: Texas Instruments; Contributor: LCSC; SMT Type: Extend; BOM_Supplier: LCSC; BOM_Supplier Part: C98969; BOM_Manufacturer Part: DRV8301DCAR; BOM_JLCPCB SMD: Yes; spicePre: U; spiceSymbolName: DRV8301DCAR

## Sheet MotorCellTwo.SchDoc: ODRIVE-FOC
size A3; DocumentNumber: SEASKY; Revision: V1.1
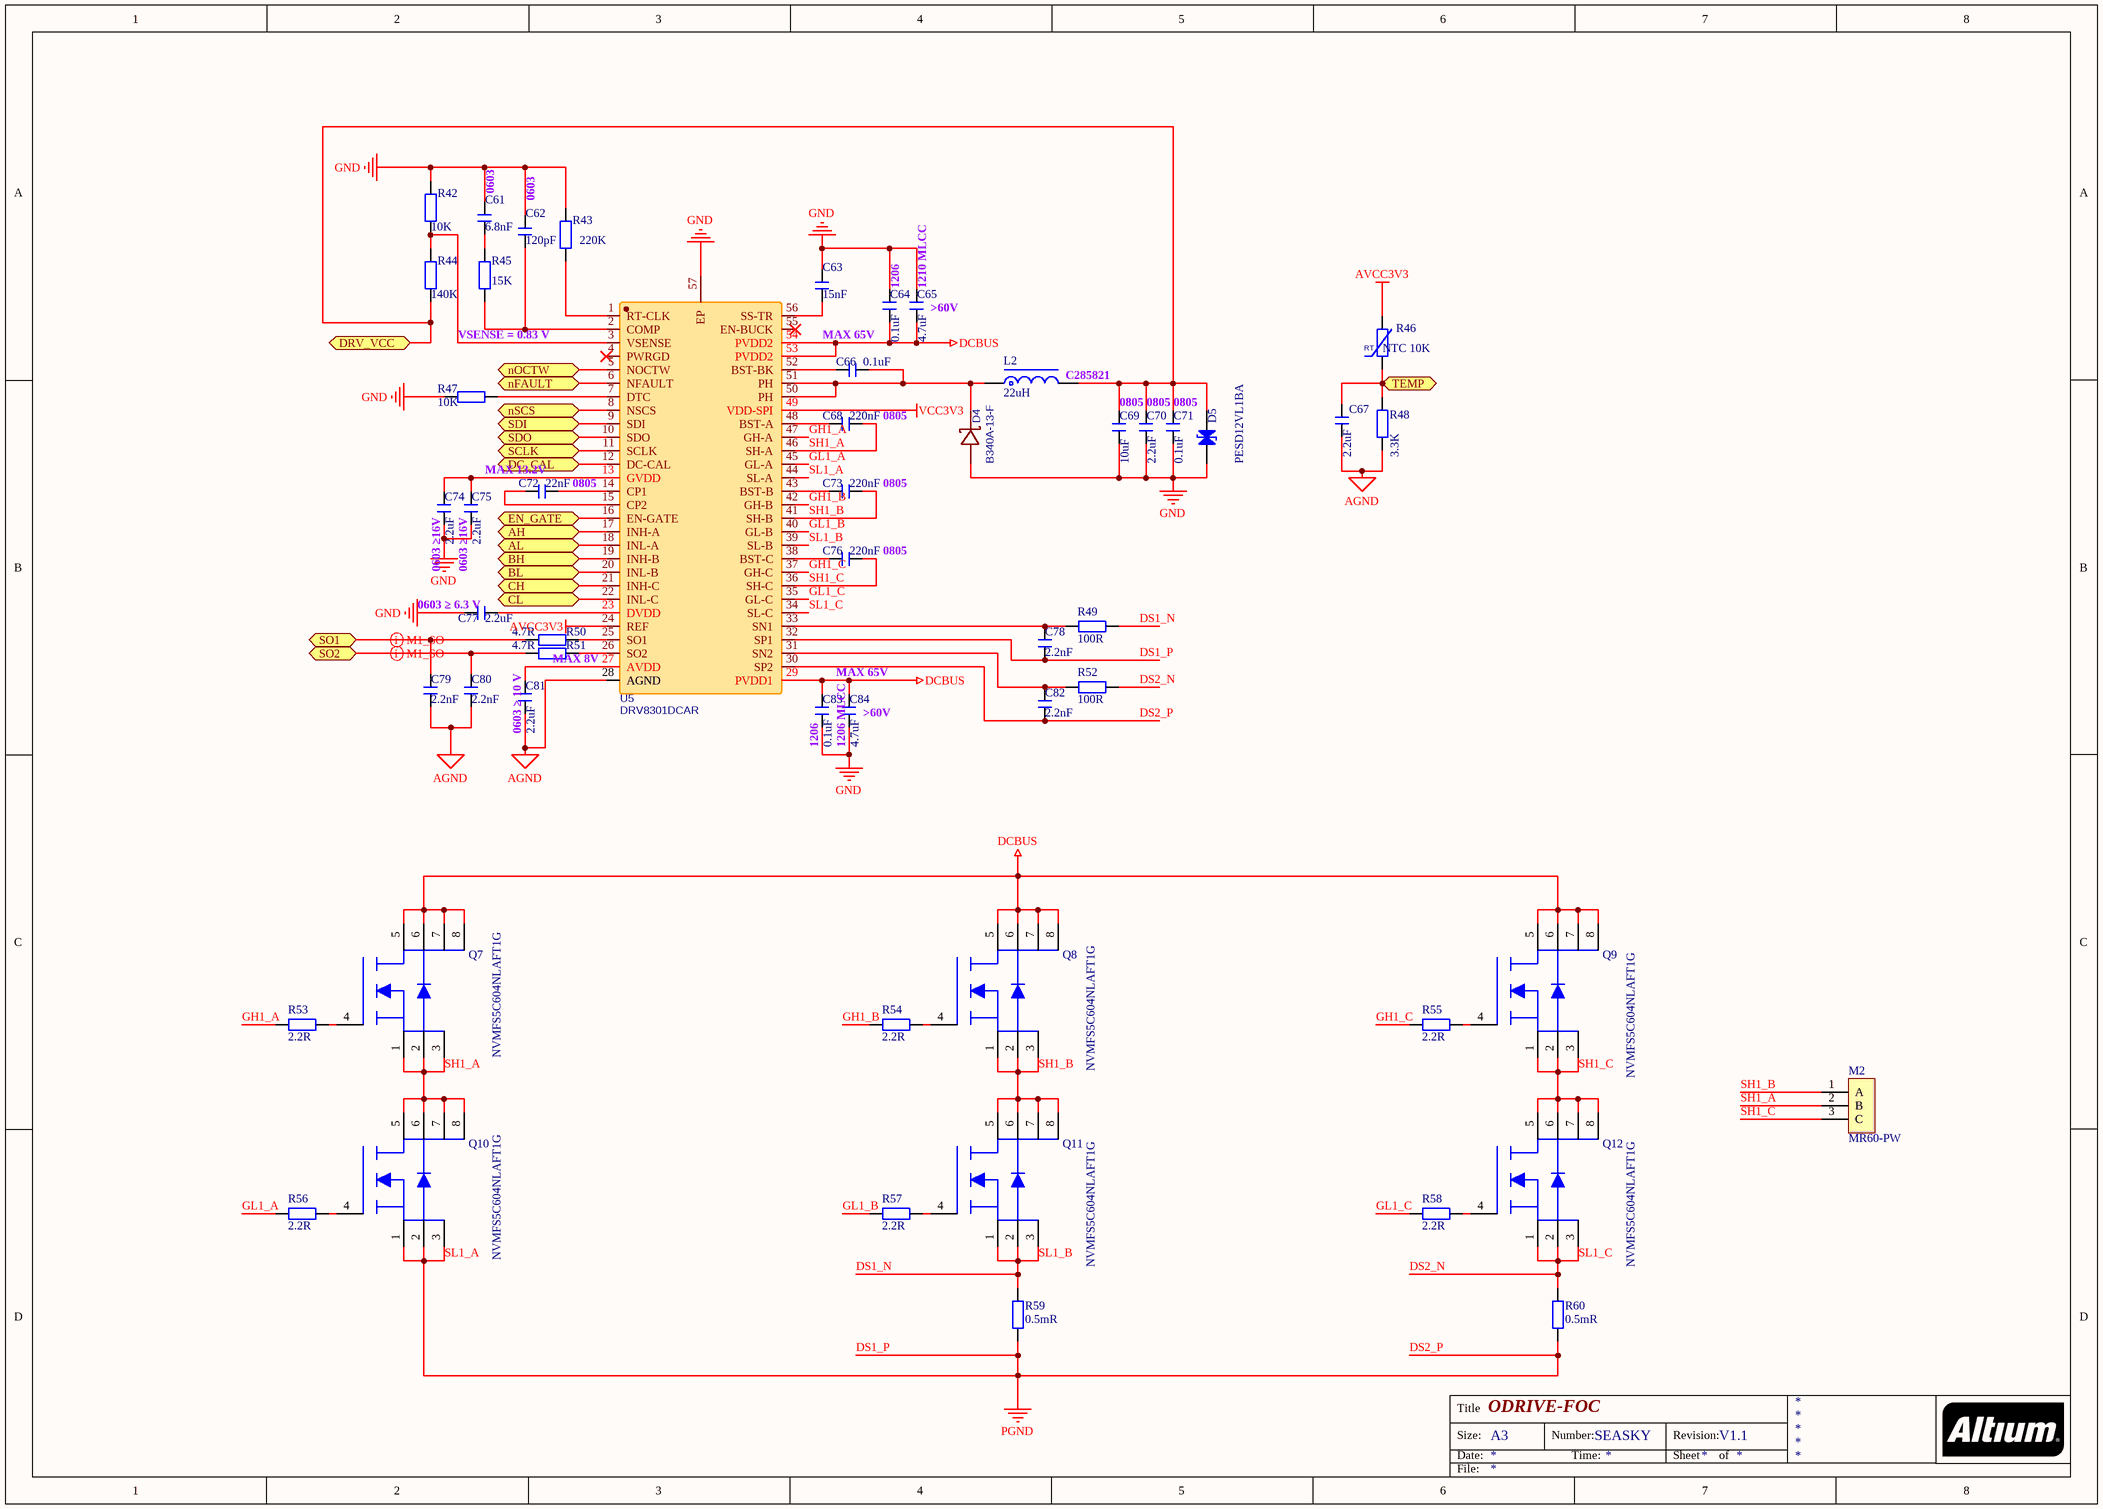
[diagram p3: MotorCellTwo.SchDoc]

### Parts
C61  6.8nF  [C 0603_L]
C62  120pF  [C 0603_L]
C63  15nF  [C 0603_L]
C64  0.1uF  [C 1206_L]
C65  4.7uF  [C 1210_L]
C66  0.1uF  [C 0603_L]
C67  2.2uF  [C 0603_L]
C68  220nF  [C 0805_L]
C69  10uF  [C 0805_L]
C70  2.2uF  [C 0805_L]
C71  0.1uF  [C 0805_L]
C72  22nF  [C 0805_L]
C73  220nF  [C 0805_L]
C74  2.2uF  [C 0603_L]
C75  2.2uF  [C 0603_L]
C76  220nF  [C 0805_L]
C77  2.2uF  [C 0603_L]
C78  2.2nF  [C 0603_L]
C79  2.2nF  [C 0603_L]
C80  2.2nF  [C 0603_L]
C81  2.2uF  [C 0603_L]
C82  2.2nF  [C 0603_L]
C83  0.1uF  [C 1206_L]
C84  4.7uF  [C 1210_L]
D4  B340A-13-F  [SMA_L4.4-W2.6-LS5.0-RD]
D5  PESD12VL1BA  [SOD-323]
L2  22uH  [CD53]
M2  MR60-PW  [MR30-PW]
Q7  NVMFS5C604NLAFT1G  [PG-TDSON-8_L5.0-W6.0-P1.27-LS6.2-BL-EP]
Q8  NVMFS5C604NLAFT1G  [PG-TDSON-8_L5.0-W6.0-P1.27-LS6.2-BL-EP]
Q9  NVMFS5C604NLAFT1G  [PG-TDSON-8_L5.0-W6.0-P1.27-LS6.2-BL-EP]
Q10  NVMFS5C604NLAFT1G  [PG-TDSON-8_L5.0-W6.0-P1.27-LS6.2-BL-EP]
Q11  NVMFS5C604NLAFT1G  [PG-TDSON-8_L5.0-W6.0-P1.27-LS6.2-BL-EP]
Q12  NVMFS5C604NLAFT1G  [PG-TDSON-8_L5.0-W6.0-P1.27-LS6.2-BL-EP]
R42  10K  [R 0603_L]
R43  220K  [R 0603_L]
R44  140K  [R 0603_L]
R45  15K  [R 0603_L]
R46  NTC 10K  [R 0805-HP_L]
R47  10K  [R 0603_L]
R48  3.3K  [R 0805_L]
R49  100R  [R 0603_L]
R50  4.7R  [R 0603_L]
R51  4.7R  [R 0603_L]
R52  100R  [R 0603_L]
R53  2.2R  [R 0603_L]
R54  2.2R  [R 0603_L]
R55  2.2R  [R 0603_L]
R56  2.2R  [R 0603_L]
R57  2.2R  [R 0603_L]
R58  2.2R  [R 0603_L]
R59  0.5mR  [R3920]
R60  0.5mR  [R3920]
U5  DRV8301DCAR  [HTSSOP-56_L14.0-W6.0-P0.50-LS8.0-BL]

### Ports
AH (bidir), AL (bidir), BH (bidir), BL (bidir), CH (bidir), CL (bidir), DC_CAL (bidir), DRV_VCC (bidir), EN_GATE (bidir), nFAULT (bidir), nOCTW (bidir), nSCS (bidir), SCLK (bidir), SDI (bidir), SDO (bidir), SO1 (bidir), SO2 (bidir), TEMP (bidir)

### Nets
AGND: C67.2 C79.1 C80.1 C81.1 R48.1 U5.28(AGND)
AVCC3V3: R46.2 U5.24(REF)
DCBUS: C64.1 C65.1 C83.2 C84.2 Q7.5 Q7.6 Q7.7 Q7.8 Q8.5 Q8.6 Q8.7 Q8.8 Q9.5 Q9.6 Q9.7 Q9.8 U5.29(PVDD1) U5.53(PVDD2) U5.54(PVDD2)
GND: C61.1 C62.1 C63.1 C64.2 C65.2 C69.1 C70.1 C71.1 C74.1 C75.1 C77.1 C83.1 C84.1 D4.2(A) D5.2(K) R42.2 R43.2 R47.2 U5.57(EP)
PGND: C78.1 C82.1 Q10.1 Q10.2 Q10.3 R59.1 R60.1 U5.30(SP2) U5.32(SP1) U5.44(SL-A)  [also labelled DS1_P, DS2_P, SL1_A]
VCC3V3: U5.49(VDD-SPI)
DS1_N: Q11.1 Q11.2 Q11.3 R49.2 R59.2 U5.39(SL-B)  [also labelled SL1_B]
DS2_N: Q12.1 Q12.2 Q12.3 R52.2 R60.2 U5.34(SL-C)  [also labelled SL1_C]
EN_GATE: U5.16(EN-GATE) ; port EN_GATE
GH1_A: R53.1 U5.47(GH-A)
GH1_B: R54.1 U5.42(GH-B)
GH1_C: R55.1 U5.37(GH-C)
GL1_A: R56.1 U5.45(GL-A)
GL1_B: R57.1 U5.40(GL-B)
GL1_C: R58.1 U5.35(GL-C)
M1_AH: U5.17(INH-A) ; port AH
M1_AL: U5.18(INL-A) ; port AL
M1_BH: U5.19(INH-B) ; port BH
M1_BL: U5.20(INL-B) ; port BL
M1_CH: U5.21(INH-C) ; port CH
M1_CL: U5.22(INL-C) ; port CL
M1_nCS: U5.8(NSCS) ; port nSCS
M1_SO_N: C79.2 R50.1 ; port SO1
M1_SO_P: C80.2 R51.1 ; port SO2
M1_TEMP: C67.1 R46.1 R48.2 ; port TEMP
nFAULT: U5.6(NFAULT) ; port nFAULT
SH1_A: C68.2 M2.2(B) Q7.1 Q7.2 Q7.3 Q10.5 Q10.6 Q10.7 Q10.8 U5.46(SH-A)
SH1_B: C73.2 M2.1(A) Q8.1 Q8.2 Q8.3 Q11.5 Q11.6 Q11.7 Q11.8 U5.41(SH-B)
SH1_C: C76.2 M2.3(C) Q9.1 Q9.2 Q9.3 Q12.5 Q12.6 Q12.7 Q12.8 U5.36(SH-C)
SPI_MISO: U5.10(SDO) ; port SDO
SPI_MOSI: U5.9(SDI) ; port SDI
SPI_SCK: U5.11(SCLK) ; port SCLK
VCC12V: C69.2 C70.2 C71.2 D5.1(A) L2.2 R44.1 ; port DRV_VCC
NetC61_2: C61.2 R45.2
NetC62_2: C62.2 R45.1 U5.2(COMP)
NetC63_2: C63.2 U5.56(SS-TR)
NetC66_1: C66.1 D4.1(K) L2.1 U5.50(PH) U5.51(PH)
NetC66_2: C66.2 U5.52(BST-BK)
NetC68_1: C68.1 U5.48(BST-A)
NetC72_1: C72.1 U5.14(CP1)
NetC72_2: C72.2 U5.15(CP2)
NetC73_1: C73.1 U5.43(BST-B)
NetC74_2: C74.2 C75.2 U5.13(GVDD)
NetC76_1: C76.1 U5.38(BST-C)
NetC77_2: C77.2 U5.23(DVDD)
NetC78_2: C78.2 R49.1 U5.33(SN1)
NetC81_2: C81.2 U5.27(AVDD)
NetC82_2: C82.2 R52.1 U5.31(SN2)
NetQ7_4: Q7.4 R53.2
NetQ8_4: Q8.4 R54.2
NetQ9_4: Q9.4 R55.2
NetQ10_4: Q10.4 R56.2
NetQ11_4: Q11.4 R57.2
NetQ12_4: Q12.4 R58.2
NetR42_1: R42.1 R44.2 U5.3(VSENSE)
NetR43_1: R43.1 U5.1(RT-CLK)
NetR47_1: R47.1 U5.7(DTC)
NetR50_2: R50.2 U5.25(SO1)
NetR51_2: R51.2 U5.26(SO2)
NetU5_5: U5.5(NOCTW) ; port nOCTW
NetU5_12: U5.12(DC-CAL) ; port DC_CAL

Not connected (* = marked no-connect by the designer): U5 4(PWRGD)* 55(EN-BUCK)*

### Layout directives
differential pair: M1_SO_N, M1_SO_P

### Notes on the sheet
- (near C61) 0603
- 0603
- 1206
- (near C65) >60V
- (near C65) 1210 MLCC
- VSENSE = 0.83 V
- MAX 65V
- (near L2) C285821
- 0805
- (near C72) MAX 13.2V
- (near C73) 0805
- (near C74) 0603 ≥16V
- (near C75) 0603 ≥16V
- (near C76) 0805
- (near C77) 0603 ≥ 6.3 V
- (near R51) MAX 8V
- (near C84) >60V
- (near C81) 0603 ≥ 10 V
- (near C83) 1206
- (near C84) 1206 MLCC
- Title
- Size:
- Date:
- A3
- Number:
- Time:
- Revision:
- Sheet
- of
- File:

### Library data of the parts
C61-C84 = C: 贴片电容
D4 = B340A-13-F: as D1 on sheet CoreCtrl; BOM_Supplier: LCSC; BOM_Manufacturer Part: B340A-13-F; BOM_Supplier Part: C85098; BOM_JLCPCB SMD: Yes; spicePre: D; spiceSymbolName: B340A-13-F
D5 = PESD5V0S1BA: PESD5V0S1BA、ESD二极管、5V
L2 = L-SMD: CD系列贴片线绕功率电感
Q7-Q12 = BSC037N08NS5ATMA1
R42-R45 R47-R58 = R: 贴片电阻
R46 = RT: 热敏电阻
R59 R60 = R-Precision: 精密贴片电阻
U5 = DRV8301DCAR: as U4 on sheet MotorCellOne; BOM_Supplier: LCSC; BOM_Supplier Part: C98969; BOM_Manufacturer Part: DRV8301DCAR; BOM_JLCPCB SMD: Yes; spicePre: U; spiceSymbolName: DRV8301DCAR

## Nets that join several sheets
AGND: CoreCtrl (C18.2 R13.1 R18.2), MotorCellOne (6 pins), MotorCellTwo (6 pins)
AVCC3V3: CoreCtrl (5 pins), MotorCellOne (R26.2 U4.24), MotorCellTwo (R46.2 U5.24)
DCBUS: CoreCtrl (17 pins), AuxHalfH (Q13.5 Q13.6 Q13.7 Q13.8), MotorCellOne (19 pins), MotorCellTwo (19 pins)
DRV5V: CoreCtrl (12 pins), MotorCellOne (6 pins)
GND: CoreCtrl (51 pins), MotorCellOne (19 pins), MotorCellTwo (19 pins)
PGND: CoreCtrl (17 pins), AuxHalfH (8 pins), MotorCellOne (10 pins), MotorCellTwo (10 pins)
VCC3V3: CoreCtrl (30 pins), MotorCellOne (U4.49), MotorCellTwo (U5.49)
AUX_H: CoreCtrl (R10.1 U1.30), AuxHalfH (R62.2 U6.5)
AUX_L: CoreCtrl (R11.1 U1.29), AuxHalfH (R63.2 U6.6)
EN_GATE: CoreCtrl (U1.33), MotorCellOne (U4.16), MotorCellTwo (U5.16)
M0_AH: CoreCtrl (U1.41), MotorCellOne (U4.17)
M0_AL: CoreCtrl (U1.34), MotorCellOne (U4.18)
M0_BH: CoreCtrl (U1.42), MotorCellOne (U4.19)
M0_BL: CoreCtrl (U1.35), MotorCellOne (U4.20)
M0_CH: CoreCtrl (U1.43), MotorCellOne (U4.21)
M0_CL: CoreCtrl (U1.36), MotorCellOne (U4.22)
M0_nCS: CoreCtrl (U1.2), MotorCellOne (U4.8)
M0_SO_N: CoreCtrl (U1.8), MotorCellOne (C56.2 R30.1)
M0_SO_P: CoreCtrl (U1.9), MotorCellOne (R31.1 R33.2)
M0_TEMP: CoreCtrl (U1.25), MotorCellOne (C44.1 R26.1 R28.2)
M1_AH: CoreCtrl (U1.37), MotorCellTwo (U5.17)
M1_AL: CoreCtrl (U1.23), MotorCellTwo (U5.18)
M1_BH: CoreCtrl (U1.38), MotorCellTwo (U5.19)
M1_BL: CoreCtrl (U1.26), MotorCellTwo (U5.20)
M1_CH: CoreCtrl (U1.39), MotorCellTwo (U5.21)
M1_CL: CoreCtrl (U1.27), MotorCellTwo (U5.22)
M1_nCS: CoreCtrl (U1.3), MotorCellTwo (U5.8)
M1_SO_N: CoreCtrl (U1.11), MotorCellTwo (C79.2 R50.1)
M1_SO_P: CoreCtrl (U1.10), MotorCellTwo (C80.2 R51.1)
M1_TEMP: CoreCtrl (U1.20), MotorCellTwo (C67.1 R46.1 R48.2)
nFAULT: CoreCtrl (U1.54), MotorCellOne (U4.6), MotorCellTwo (U5.6)
SPI_MISO: CoreCtrl (P6.4 P7.4 U1.52), MotorCellOne (U4.10), MotorCellTwo (U5.10)
SPI_MOSI: CoreCtrl (P6.5 P7.5 U1.53), MotorCellOne (U4.9), MotorCellTwo (U5.9)
SPI_SCK: CoreCtrl (P6.3 P7.3 U1.51), MotorCellOne (U4.11), MotorCellTwo (U5.11)
VCC12V: AuxHalfH (C86.1 U6.1), MotorCellTwo (6 pins)